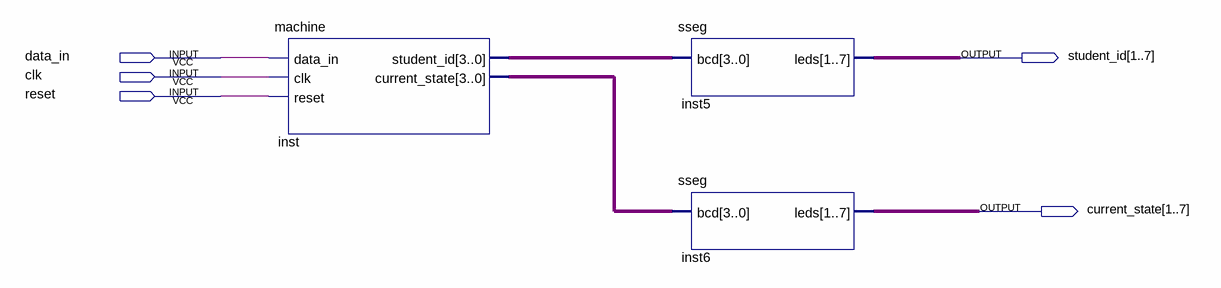
[diagram p0: schematic sheet]
// Quartus schematic combined.bdf as structural Verilog: 3 symbols, 5 pins
module combined (
  input  data_in,
  input  clk,
  input  reset,
  output [1:7] student_id,
  output [1:7] current_state
);

  wire [3:0] inst_current_state, inst_student_id;

  machine inst (
    .data_in(data_in), .clk(clk), .reset(reset), .student_id(inst_student_id),
    .current_state(inst_current_state));
  sseg inst5 (.bcd(inst_student_id), .leds(student_id));
  sseg inst6 (.bcd(inst_current_state), .leds(current_state));
endmodule
